# EAGLE schematic POD_smallbox (EAGLE 4.13)
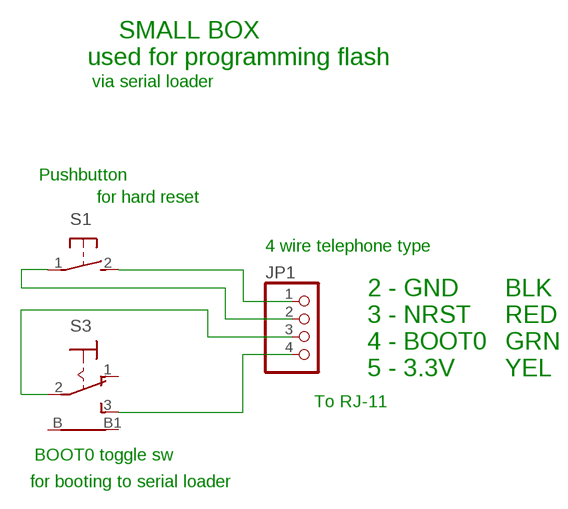
[diagram p0: schematic, sheet 1]

## Parts
JP1  PINHD-1X4  [1X04]
S1  31-XX  [B3F-31XX]
S3  LPV-1  [LPV-1]

## Nets
BOOT0: JP1.4 S3.3(S)
N$1: JP1.2 S1.1(P)
NRST: JP1.1 S1.2(S)
VCC_3.3V: JP1.3 S3.2(P)
Unconnected: S3.1(O) S3.B S3.B1

## Notes on the sheet
- SMALL BOX
- used for programming flash
- via serial loader
- Pushbutton
- for hard reset
- 4 wire telephone type
- 2 - GND | BLK
- 3 - NRST | RED
- 4 - BOOT0 | GRN
- 5 - 3.3V | YEL
- To RJ-11
- BOOT0 toggle sw
- for booting to serial loader

## Library data of the parts
JP1 = pinhead:PINHD-1X4: PIN HEADER
S1 = switch-omron:31-XX: OMRON SWITCH
S3 = switch:LPV-1: TOGGLE SWITCH

## Net classes
0 default: width 0.406 mm, clearance 0.711 mm